# EAGLE schematic Speccy2007_128K_Ljubitel (EAGLE 6.3)
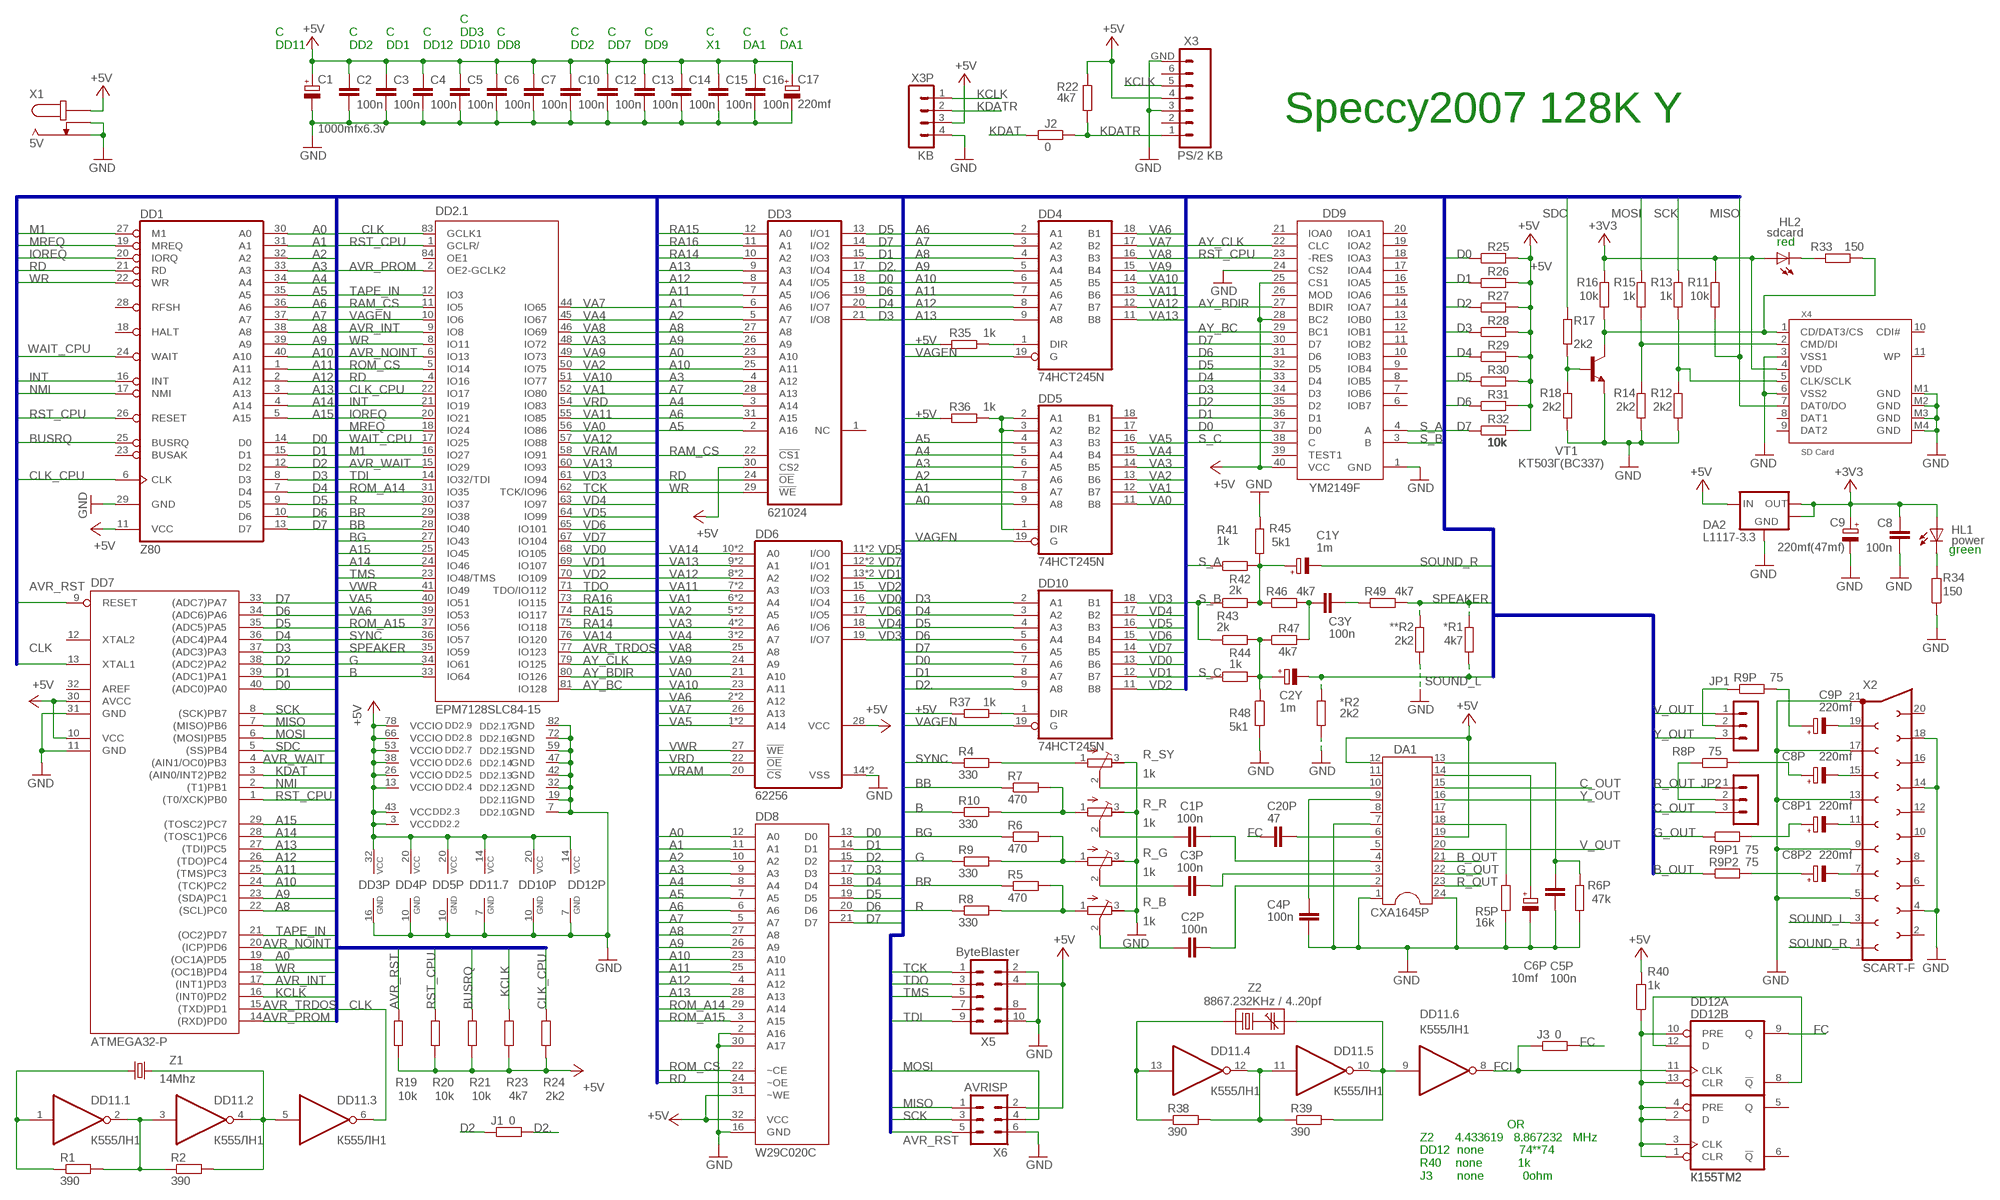
[diagram p0: schematic, sheet 1]

## Parts
**R2  2k2  R-EU_R1206  [R1206]
*R1  4k7  R-EU_R0805  [R0805]
*R2  2k2  R-EU_R0805  [R0805]
C1  1000mfx6.3v  CPOL-EUE3.5-8  [E3,5-8]
C1P  100n  C-EUC0805  [C0805]
C1Y  1m  CPOL-EUE2.5-5  [E2,5-5]
C2  100n  C-EUC0805  [C0805]
C2P  100n  C-EUC0805  [C0805]
C2Y  1m  CPOL-EUE2.5-5  [E2,5-5]
C3  100n  C-EUC0805  [C0805]
C3P  100n  C-EUC0805  [C0805]
C3Y  100n  C-EUC0805  [C0805]
C4  100n  C-EUC1206  [C1206]
C4P  100n  C-EUC0805  [C0805]
C5  100n  C-EUC0805  [C0805]
C5P  100n  C-EUC1206  [C1206]
C6  100n  C-EUC1206  [C1206]
C6P  10mf  CPOL-EUE2.5-5  [E2,5-5]
C7  100n  C-EUC0805  [C0805]
C8  100n  C-EUC0805  [C0805]
C8P  220mf  CPOL-EUE2.5-6  [E2,5-6]
C8P1  220mf  CPOL-EUE2.5-6  [E2,5-6]
C8P2  220mf  CPOL-EUE2.5-6  [E2,5-6]
C9  220mf(47mf)  CPOL-EUE2.5-6  [E2,5-6]
C9P  220mf  CPOL-EUE2.5-6  [E2,5-6]
C10  100n  C-EUC0805  [C0805]
C12  100n  C-EUC0805  [C0805]
C13  100n  C-EUC0805  [C0805]
C14  100n  C-EUC0805  [C0805]
C15  100n  C-EUC0805  [C0805]
C16  100n  C-EUC0805  [C0805]
C17  220mf  CPOL-EUE2.5-6  [E2,5-6]
C20P  47  C-EUC0805  [C0805]
DA1  CXA1645P  CXA1645-P  [DIL24-4]
DA2  L1117-3.3  AP1117  [SOT-223]
DD1  Z80  Z80CPU  [DIL40]
DD2  EPM7128SLC84-15  EPM7128-J84  [PGA-84-B]
DD3  621024  621024P  [DIL32]
DD4  74HCT245N  74HC245N  [DIL20]
DD5  74HCT245N  74HC245N  [DIL20]
DD6  62256  62256P+  [DIL28+6]
DD7  ATMEGA32-P  MEGA16-P  [DIL40]
DD8  W29C020C  [DIL32]
DD9  YM2149F  [DIL40]
DD10  74HCT245N  74HC245N  [DIL20]
DD11  К555ЛН1  74LS04N  [DIL14]
DD12  К155ТМ2  74LS74O  [DIL14O]
HL1  power  LEDSML0805  [SML0805]
HL2  sdcard  LEDSML0805  [SML0805]
J1  0  R-EU_M1206  [M1206]
J2  0  R-EU_R1206  [R1206]
J3  0  R-EU_R0805  [R0805]
JP1  MA03-1  [MA03-1]
JP2  MA03-1  [MA03-1]
R1  390  R-EU_R0805  [R0805]
R2  390  R-EU_R0805  [R0805]
R4  330  R-EU_R0805  [R0805]
R5  470  R-EU_R0805  [R0805]
R5P  16k  R-EU_M1206  [M1206]
R6  470  R-EU_R1206  [R1206]
R6P  47k  R-EU_R0805  [R0805]
R7  470  R-EU_0207/10  [0207/10]
R8  330  R-EU_R0805  [R0805]
R8P  75  R-EU_R1206  [R1206]
R9  330  R-EU_R0805  [R0805]
R9P  75  R-EU_R1206  [R1206]
R9P1  75  R-EU_R1206  [R1206]
R9P2  75  R-EU_R1206  [R1206]
R10  330  R-EU_R0805  [R0805]
R11  10k  R-EU_R0805  [R0805]
R12  2k2  R-EU_R1206  [R1206]
R13  1k  R-EU_R0805  [R0805]
R14  2k2  R-EU_R0805  [R0805]
R15  1k  R-EU_R0805  [R0805]
R16  10k  R-EU_R0805  [R0805]
R17  2k2  R-EU_R0805  [R0805]
R18  2k2  R-EU_R0805  [R0805]
R19  10k  R-EU_M0805  [M0805]
R20  10k  R-EU_R0805  [R0805]
R21  10k  R-EU_0207/10  [0207/10]
R22  4k7  R-EU_R0805  [R0805]
R23  4k7  R-EU_R1206  [R1206]
R24  2k2  R-EU_0207/10  [0207/10]
R25  10k  R-EU_R0805  [R0805]
R26  10k  R-EU_M0805  [M0805]
R27  10k  R-EU_R0805  [R0805]
R28  10k  R-EU_R0805  [R0805]
R29  10k  R-EU_R0805  [R0805]
R30  10k  R-EU_R0805  [R0805]
R31  10k  R-EU_R0805  [R0805]
R32  10k  R-EU_R0805  [R0805]
R33  150  R-EU_R1206  [R1206]
R34  150  R-EU_R0805  [R0805]
R35  1k  R-EU_R0805  [R0805]
R36  1k  R-EU_R0805  [R0805]
R37  1k  R-EU_R0805  [R0805]
R38  390  R-EU_R0805  [R0805]
R39  390  R-EU_R0805  [R0805]
R40  1k  R-EU_R0805  [R0805]
R41  1k  R-EU_R0805  [R0805]
R42  2k  R-EU_R0805  [R0805]
R43  2k  R-EU_R1206  [R1206]
R44  1k  R-EU_R1206  [R1206]
R45  5k1  R-EU_R1206  [R1206]
R46  4k7  R-EU_R1206  [R1206]
R47  4k7  R-EU_R0805  [R0805]
R48  5k1  R-EU_R0805  [R0805]
R49  4k7  R-EU_R0805  [R0805]
R_B  1k  R-TRIMM3296W  [RTRIM3296W]
R_G  1k  R-TRIMM3296W  [RTRIM3296W]
R_R  1k  R-TRIMM3296W  [RTRIM3296W]
R_SY  1k  R-TRIMM3296W  [RTRIM3296W]
VT1  KT503Г(BC337)  BC550-NPN-TO92-CBE  [TO92-CBE]
X1  5V  POWER3.5  [POWER3.5]
X2  SCART-F  [SCART-F]
X3  PS/2 KB  MINI-DIN6PTH  [MINI-DIN6]
X3P  KB  MA04-1  [MA04-1]
X4  SD Card  SDCARD  [SDCMF-10915W010]
X5  ByteBlaster  MA05-2  [MA05-2]
X6  AVRISP  MA03-2  [MA03-2]
Z1  14Mhz  CRYSTALHC49U-H  [HC49U-H]
Z2  8867.232KHz / 4..20pf  ZC  [HC49U-H]

## Nets
+3V3: C8.1 C9.+ DA2.2(OUT) DA2.4(OUT') HL1.A HL2.A R11.2 R16.2 X4.4(VDD)
+5V: C1.+ C2.1 C3.1 C4.1 C5.1 C6.1 C7.1 C10.1 C12.1 C13.1 C14.1 C15.1 C16.1 C17.+ DA1.12 DA1.19 DA2.3(IN) DD1.11(VCC) DD2.3(.2:VCC) DD2.13(.4:VCCIO) DD2.26(.5:VCCIO) DD2.38(.6:VCCIO) DD2.43(.3:VCC) DD2.53(.7:VCCIO) DD2.66(.8:VCCIO) DD2.78(.9:VCCIO) DD3.30(CS2) DD3.32(VCC) DD4.20(VCC) DD5.20(VCC) DD6.28(VCC) DD7.10(VCC) DD7.30(AVCC) DD8.31(~WE) DD8.32(VCC) DD9.25(CS1) DD9.28(BC2) DD9.40(VCC) DD10.20(VCC) DD11.14(.7:VCC) DD12.14(P:VCC) R19.1 R20.1 R21.1 R22.2 R23.1 R24.1 R25.2 R26.2 R27.2 R28.2 R29.2 R30.2 R31.2 R32.2 R35.2 R36.2 R37.2 R40.2 X1.P$1 X3.4 X3P.3 X5.4 X6.2
A0: DD1.30(A0) DD3.23(A10) DD5.9(A8) DD7.19((OC1A)PD5) DD8.12(A0)
A1: DD1.31(A1) DD3.6(A6) DD5.8(A7) DD8.11(A1)
A2: DD1.32(A2) DD3.5(A7) DD5.7(A6) DD8.10(A2)
A3: DD1.33(A3) DD3.4(A12) DD5.6(A5) DD8.9(A3)
A4: DD1.34(A4) DD3.3(A14) DD5.5(A4) DD8.8(A4)
A5: DD1.35(A5) DD3.2(A16) DD5.4(A3) DD8.7(A5)
A6: DD1.36(A6) DD3.31(A15) DD4.2(A1) DD8.6(A6)
A7: DD1.37(A7) DD3.28(A13) DD4.3(A2) DD8.5(A7)
A8: DD1.38(A8) DD3.27(A8) DD4.4(A3) DD7.22((SCL)PC0) DD8.27(A8)
A9: DD1.39(A9) DD3.26(A9) DD4.5(A4) DD7.23((SDA)PC1) DD8.26(A9)
A10: DD1.40(A10) DD3.25(A11) DD4.6(A5) DD7.24((TCK)PC2) DD8.23(A10)
A11: DD1.1(A11) DD3.7(A5) DD4.7(A6) DD7.25((TMS)PC3) DD8.25(A11)
A12: DD1.2(A12) DD3.8(A4) DD4.8(A7) DD7.26((TDO)PC4) DD8.4(A12)
A13: DD1.3(A13) DD3.9(A3) DD4.9(A8) DD7.27((TDI)PC5) DD8.28(A13)
A14: DD1.4(A14) DD2.24(.1:IO46) DD7.28((TOSC1)PC6)
A15: DD1.5(A15) DD2.25(.1:IO45) DD7.29((TOSC2)PC7)
AVR_INT: DD2.9(.1:IO8) DD7.17((INT1)PD3)
AVR_NOINT: DD2.6(.1:IO13) DD7.20((ICP)PD6)
AVR_PROM: DD2.2(.1:OE2-GCLK2) DD7.14((RXD)PD0)
AVR_RST: DD7.9(RESET) R19.2 X6.5
AVR_TRDOS: DD2.77(.1:IO123) DD7.15((TXD)PD1)
AVR_WAIT: DD2.15(.1:IO29) DD7.4((AIN1/OC0)PB3)
AY_BC: DD2.81(.1:IO128) DD9.29(BC1)
AY_BDIR: DD2.80(.1:IO126) DD9.27(BDIR)
AY_CLK: DD2.79(.1:IO125) DD9.22(CLC)
B: DD2.33(.1:IO64) R10.1
B_OUT: DA1.21 R9P2.1
BB: DD2.28(.1:IO40) R7.1
BG: DD2.27(.1:IO43) R6.1
BR: DD2.29(.1:IO38) R5.1
BUSRQ: DD1.25(BUSRQ) R21.2
C_OUT: DA1.15 JP2.3
CLK: DD2.83(.1:GCLK1) DD7.13(XTAL1) DD11.6(.3:O)
CLK_CPU: DD1.6(CLK) DD2.22(.1:IO17) R24.2
D0: DD1.14(D0) DD3.18(I/O5) DD7.40((ADC0)PA0) DD8.13(D0) DD9.37(D0) DD10.7(A6) R25.1
D1: DD1.15(D1) DD3.15(I/O3) DD7.39((ADC1)PA1) DD8.14(D1) DD9.36(D1) DD10.8(A7) R26.1
D2: DD1.12(D2) DD7.38((ADC2)PA2) DD9.35(D2) J1.1 R27.1
D2.: DD3.17(I/O4) DD8.15(D2) DD10.9(A8) J1.2
D3: DD1.8(D3) DD3.21(I/O8) DD7.37((ADC3)PA3) DD8.17(D3) DD9.34(D3) DD10.2(A1) R28.1
D4: DD1.7(D4) DD3.20(I/O7) DD7.36((ADC4)PA4) DD8.18(D4) DD9.33(D4) DD10.3(A2) R29.1
D5: DD1.9(D5) DD3.13(I/O1) DD7.35((ADC5)PA5) DD8.19(D5) DD9.32(D5) DD10.4(A3) R30.1
D6: DD1.10(D6) DD3.19(I/O6) DD7.34((ADC6)PA6) DD8.20(D6) DD9.31(D6) DD10.5(A4) R31.1
D7: DD1.13(D7) DD3.14(I/O2) DD7.33((ADC7)PA7) DD8.21(D7) DD9.30(D7) DD10.6(A5) R32.1
FC: C20P.1 DD12.9(B:Q) J3.2
FCI: DD11.8(.6:O) DD12.11(B:CLK) J3.1
G: DD2.34(.1:IO61) R9.1
G_OUT: DA1.22 R9P1.1
GND: **R2.1 *R2.1 C1.- C2.2 C3.2 C4.2 C4P.1 C5.2 C5P.1 C6.2 C6P.- C7.2 C8.2 C9.- C10.2 C12.2 C13.2 C14.2 C15.2 C16.2 C17.- DA1.1 DA1.7 DA1.24 DA2.1(GND) DD1.29(GND) DD2.7(.10:GND) DD2.19(.11:GND) DD2.32(.12:GND) DD2.42(.13:GND) DD2.47(.14:GND) DD2.59(.15:GND) DD2.72(.16:GND) DD2.82(.17:GND) DD3.16(GND) DD4.10(GND) DD5.10(GND) DD6.14(VSS) DD6.P$14(VSS) DD7.11(GND) DD7.31(GND) DD8.2(A16) DD8.16(GND) DD8.30(A17) DD9.1(GND) DD9.24(CS2) DD10.10(GND) DD11.7(.7:GND) DD12.7(P:GND) R5P.1 R6P.1 R12.1 R14.1 R18.1 R34.1 R45.2 R48.2 R_B.3(A) R_G.3(A) R_R.3(A) R_SY.3(A) VT1.E X1.P$2 X1.P$3 X2.4 X2.5 X2.9 X2.13 X2.14 X2.17 X2.18 X2.21 X3.3 X3.GND X3P.4 X4.3(VSS1) X4.6(VSS2) X4.M1(GND) X4.M2(GND) X4.M3(GND) X4.M4(GND) X5.2 X5.10 X6.6
INT: DD1.16(INT) DD2.21(.1:IO19)
IOREQ: DD1.20(IORQ) DD2.20(.1:IO21)
KCLK: DD7.16((INT0)PD2) R23.2 X3.5 X3P.1
KDAT: DD7.3((AIN0/INT2)PB2) J2.1
KDATR: J2.2 R22.1 X3.1 X3P.2
M1: DD1.27(M1) DD2.16(.1:IO27)
MISO: DD7.7((MISO)PB6) R11.1 X4.7(DAT0/DO) X6.1
MOSI: DD7.6((MOSI)PB5) R15.2 X6.4
MREQ: DD1.19(MREQ) DD2.18(.1:IO24)
N$1: DD11.4(.2:O) DD11.5(.3:I) R2.2 Z1.2
N$2: C3Y.1 R46.2 R47.2
N$3: C3Y.2 R49.1
N$4: C1Y.+ R41.2 R42.2 R45.1 R46.1
N$5: DD11.2(.1:O) DD11.3(.2:I) R1.2 R2.1
N$6: R4.2 R_SY.1(E)
N$7: C2Y.+ R43.2 R44.2 R47.1 R48.1
N$8: R7.2 R10.2 R_R.1(E)
N$9: R6.2 R9.2 R_G.1(E)
N$10: R5.2 R8.2 R_B.1(E)
N$11: C1P.1 R_R.2(S)
N$12: DD11.1(.1:I) R1.1 Z1.1
N$13: C3P.1 R_G.2(S)
N$14: C2P.1 R_B.2(S)
N$16: R16.1 R33.1 VT1.C X4.1(CD/DAT3/CS)
N$17: R17.1 R18.2 VT1.B
N$19: R12.2 R13.1 X4.5(CLK/SCLK)
N$21: R14.2 R15.1 X4.2(CMD/DI)
N$22: DA1.10 R_SY.2(S)
N$23: DD10.1(DIR) R37.1
N$24: DD5.1(DIR) DD5.2(A1) DD5.3(A2) R36.1
N$27: C9P.- X2.19
N$28: JP1.2 R9P.1
N$29: C4P.2 DA1.9
N$30: C8P.- X2.15
N$31: JP2.2 R8P.1
N$32: C8P1.- X2.11
N$33: C8P2.- X2.7
N$34: C8P1.+ R9P1.2
N$35: C2P.2 DA1.2
N$36: C8P2.+ R9P2.2
N$38: DD12.8(B:!Q) DD12.12(B:D)
N$39: HL1.C R34.2
N$40: DD12.1(A:CLR) DD12.2(A:D) DD12.3(A:CLK) DD12.4(A:PRE) DD12.10(B:PRE) DD12.13(B:CLR) R40.1
N$41: HL2.C R33.2
N$42: DD4.1(DIR) R35.1
N$43: DD11.11(.5:I) DD11.12(.4:O) R38.2 R39.1
N$44: DD11.9(.6:I) DD11.10(.5:O) R39.2 Z2.2
N$45: DD11.13(.4:I) R38.1 Z2.1
N$46: C3P.2 DA1.3
N$47: C1P.2 DA1.4
N$49: C9P.+ R9P.2
N$50: DA1.18 R5P.2
N$52: C5P.2 DA1.13 R6P.2
N$53: C6P.+ DA1.14
N$57: C8P.+ R8P.2
N$62: C20P.2 DA1.6
NMI: DD1.17(NMI) DD7.2((T1)PB1)
R: DD2.30(.1:IO37) R8.1
R_OUT: DA1.23 JP2.1
RA14: DD2.75(.1:IO118) DD3.10(A2)
RA15: DD2.74(.1:IO117) DD3.12(A0)
RA16: DD2.73(.1:IO115) DD3.11(A1)
RAM_CS: DD2.11(.1:IO5) DD3.22(!CS1)
RD: DD1.21(RD) DD2.4(.1:IO16) DD3.24(!OE) DD8.24(~OE)
ROM_A14: DD2.31(.1:IO35) DD8.29(A14)
ROM_A15: DD2.37(.1:IO56) DD8.3(A15)
ROM_CS: DD2.5(.1:IO14) DD8.22(~CE)
RST_CPU: DD1.26(RESET) DD2.1(.1:GCLR/) DD7.1((T0/XCK)PB0) DD9.23(-RES) R20.2
S_A: DD9.4(A) R41.1
S_B: DD9.3(B) R42.1 R43.1
S_C: DD9.38(C) R44.1
SCK: DD7.8((SCK)PB7) R13.2 X6.3
SDC: DD7.5((SS)PB4) R17.2
SOUND_L: *R1.1 *R2.2 C2Y.- X2.3
SOUND_R: C1Y.- X2.1
SPEAKER: **R2.2 *R1.2 DD2.35(.1:IO59) R49.2
SYNC: DD2.36(.1:IO57) R4.1
TAPE_IN: DD2.12(.1:IO3) DD7.21((OC2)PD7)
TCK: DD2.62(.1:TCK/IO96) X5.1
TDI: DD2.14(.1:IO32/TDI) X5.9
TDO: DD2.71(.1:TDO/IO112) X5.3
TMS: DD2.23(.1:IO48/TMS) X5.5
V_OUT: DA1.20 JP1.1
VA0: DD2.56(.1:IO86) DD5.11(B8) DD6.21(A10)
VA1: DD2.52(.1:IO80) DD5.12(B7) DD6.6(A4) DD6.P$6(A4)
VA2: DD2.50(.1:IO75) DD5.13(B6) DD6.5(A5) DD6.P$5(A5)
VA3: DD2.48(.1:IO72) DD5.14(B5) DD6.4(A6) DD6.P$4(A6)
VA4: DD2.45(.1:IO67) DD5.15(B4) DD6.3(A7) DD6.P$3(A7)
VA5: DD2.40(.1:IO51) DD5.16(B3) DD6.1(A14) DD6.P$1(A14)
VA6: DD2.39(.1:IO53) DD4.18(B1) DD6.2(A12) DD6.P$2(A12)
VA7: DD2.44(.1:IO65) DD4.17(B2) DD6.26(A13)
VA8: DD2.46(.1:IO69) DD4.16(B3) DD6.25(A8)
VA9: DD2.49(.1:IO73) DD4.15(B4) DD6.24(A9)
VA10: DD2.51(.1:IO77) DD4.14(B5) DD6.23(A11)
VA11: DD2.55(.1:IO85) DD4.13(B6) DD6.7(A3) DD6.P$7(A3)
VA12: DD2.57(.1:IO88) DD4.12(B7) DD6.8(A2) DD6.P$8(A2)
VA13: DD2.60(.1:IO93) DD4.11(B8) DD6.9(A1) DD6.P$9(A1)
VA14: DD2.76(.1:IO120) DD6.10(A0) DD6.P$10(A0)
VAGEN: DD2.10(.1:IO6) DD4.19(G) DD5.19(G) DD10.19(G)
VD0: DD2.68(.1:IO105) DD6.16(I/O4) DD10.13(B6)
VD1: DD2.69(.1:IO107) DD6.13(I/O2) DD6.P$13(I/O2) DD10.12(B7)
VD2: DD2.70(.1:IO109) DD6.15(I/O3) DD10.11(B8)
VD3: DD2.61(.1:IO94) DD6.19(I/O7) DD10.18(B1)
VD4: DD2.63(.1:IO97) DD6.18(I/O6) DD10.17(B2)
VD5: DD2.64(.1:IO99) DD6.11(I/O0) DD6.P$11(I/O0) DD10.16(B3)
VD6: DD2.65(.1:IO101) DD6.17(I/O5) DD10.15(B4)
VD7: DD2.67(.1:IO104) DD6.12(I/O1) DD6.P$12(I/O1) DD10.14(B5)
VRAM: DD2.58(.1:IO91) DD6.20(!CS)
VRD: DD2.54(.1:IO83) DD6.22(!OE)
VWR: DD2.41(.1:IO49) DD6.27(!WE)
WAIT_CPU: DD1.24(WAIT) DD2.17(.1:IO25)
WR: DD1.22(WR) DD2.8(.1:IO11) DD3.29(!WE) DD7.18((OC1B)PD4)
Y_OUT: DA1.16 JP1.3
Unconnected: DA1.5 DA1.8 DA1.11 DA1.17 DD1.18(HALT) DD1.23(BUSAK) DD1.28(RFSH) DD2.84(.1:OE1) DD3.1(NC) DD5.17(B2) DD5.18(B1) DD7.12(XTAL2) DD7.32(AREF) DD9.6(IOB7) DD9.7(IOB6) DD9.8(IOB5) DD9.9(IOB4) DD9.10(IOB3) DD9.11(IOB2) DD9.12(IOB1) DD9.13(IOB0) DD9.14(IOA7) DD9.15(IOA6) DD9.16(IOA5) DD9.17(IOA4) DD9.18(IOA3) DD9.19(IOA2) DD9.20(IOA1) DD9.21(IOA0) DD9.26(MOD) DD9.39(TEST1) DD12.5(A:Q) DD12.6(A:!Q) X2.2 X2.6 X2.8 X2.10 X2.12 X2.16 X2.20 X3.2 X3.6 X4.8(DAT1) X4.9(DAT2) X4.10(CDI#) X4.11(WP) X5.7 X5.8

## Buses
A,A[0..15],RA[14..16],AVR_INT,AVR_NOINT,AVR_PROM,AVR_RST,AVR_TRDOS,AVR_WAIT,AY_BC,AY_BDIR,AY_CLK,B,BB,BG,BR,BUSRQ,C,CLK,CLK_CPU,D[0..7],D2.,G,INT,IOREQ,KCLK,KDAT,M1,MISO,MOSI,MREQ,NMI,R,RAM_A[14..16],RAM_CS,RD,ROM_A[14..15],ROM_CS,RST_CPU,SCK,SDC,SOUND_L,SOUND_R,SPEAKER,SYNC,TAPE_IN,TCK,TDI,TDO,TMS,VA[0..14],VAGEN,VD[0..7],VRAM,VRD,VWR,WAIT_CPU,WR,B_OUT,C_OUT,G_OUT,R_OUT,Y_OUT,S_A,S_B,S_C,V_OUT,+5V

## Notes on the sheet
- C
  DD11
- C
  DD2
- C
  DD1
- C
  DD12
- C
  DD3
  DD10
- C
  DD8
- C
  DD2
- C
  DD7
- C
  DD9
- C
  X1
- C
  DA1
- C
  DA1
- Speccy2007 128K Y
- red
- green
- OR
  Z2      4.433619   8.867232   MHz
  DD12  none          74**74
  R40    none          1k
  J3       none           0ohm

## Library data of the parts
**R2 *R1 *R2 J1-J3 R1 R2 R4 R5 R5P R6 R6P R8 R8P R9 R9P R9P1 R9P2 R10-R20 R22 R23 R25-R49 = rcl:R-EU_: RESISTOR, European symbol
C1 C1Y C2Y C6P C8P C8P1 C8P2 C9 C9P C17 = Speccy:CPOL-EU: POLARIZED CAPACITOR, European symbol
C1P C2 C2P C3 C3P C3Y C4 C4P C5 C5P C6-C8 C10 C12-C16 C20P = rcl:C-EU: CAPACITOR, European symbol
DA1 = cxa1645:CXA1645: Dual In Line
DA2 = AWJLEagleLib:AP1117: Diodes Incorporated AP1117 LDO adjustable regulator
DD1 = zilog:Z80CPU: Z80 FAMILY DEVICE
DD2 = Speccy:EPM7128-J84: EPM70128 MAX 7000 family
DD3 = Speccy:621024: MEMORY; OC_FARNELL: unknown; OC_NEWARK: unknown
DD4 DD5 DD10 = Speccy:74*245: Octal BUS TRANSCEIVER, 3-state
DD6 = Speccy:62256: MEMORY
DD7 = atmel:MEGA16-P: MICROCONTROLLER 16 Kbytes FLASH 1 kbytes SRAM 512 bytes EEPROM USART 8-channel 10 bit ADC Source: avr.lbr; MPN: ATMEGA16-16PU; OC_FARNELL: 9171142; OC_NEWARK: 01M6885
DD8 = w29c020:W29C020
DD9 = ref-pack_:YM2149F
DD11 = Speccy:74*04: Hex INVERTER
DD12 = Speccy:74*74: Dual D type positive edge triggered FLIP FLOP, preset and clear
HL1 HL2 = led:LED: LED OSRAM: - CHIPLED LG R971, LG N971, LY N971, LG Q971, LY Q971, LO R971, LY R971 LH N974, LH R974 LS Q976, LO Q976, LY Q976 LO Q996 - Hyper CHIPLED LW Q18S LB Q993, LB Q99A, LB R99A - SideLED LS A670, LO A670, LY A670, LG A670, LP A670 LB A673, LV A673, LT A673, LW A673 LH A674 LY A675 LS A676, LA A676, LO A676, LY A676, LW A676 LS A679, LY A679, LG A679 - Hyper Micro SIDELED® LS Y876, LA Y876, LO Y876, LY Y876 LT Y87S - SmartLED LW L88C, LW L88S LB L89C, LB L89S, LG L890 LS L89K, LO L89K, LY L89K LS L896, LA L896, LO L896, LY L896 - TOPLED LS T670, LO T670, LY T670, LG T670, LP T670 LSG T670, LSP T670, LSY T670, LOP T670, LYG T670 LG T671, LOG T671, LSG T671 LB T673, LV T673, LT T673, LW T673 LH T674 LS T676, LA T676, LO T676, LY T676, LB T676, LH T676, LSB T676, LW T676 LB T67C, LV T67C, LT T67C, LS T67K, LO T67K, LY T67K, LW E67C LS E67B, LA E67B, LO E67B, LY E67B, LB E67C, LV E67C, LT E67C LW T67C LS T679, LY T679, LG T679 LS T770, LO T770, LY T770, LG T770, LP T770 LB T773, LV T773, LT T773, LW T773 LH T774 LS E675, LA E675, LY E675, LS T675 LS T776, LA T776, LO T776, LY T776, LB T776 LHGB T686 LT T68C, LB T68C - Hyper Mini TOPLED® LB M676 - Mini TOPLED Santana® LG M470 LS M47K, LO M47K, LY M47K Source: http://www.osram.convergy.de LUXEON: - LUMILED® LXK2-PW12-R00, LXK2-PW12-S00, LXK2-PW14-U00, LXK2-PW14-V00 LXK2-PM12-R00, LXK2-PM12-S00, LXK2-PM14-U00 LXK2-PE12-Q00, LXK2-PE12-R00, LXK2-PE12-S00, LXK2-PE14-T00, LXK2-PE14-U00 LXK2-PB12-K00, LXK2-PB12-L00, LXK2-PB12-M00, LXK2-PB14-N00, LXK2-PB14-P00, LXK2-PB14-Q00 LXK2-PR12-L00, LXK2-PR12-M00, LXK2-PR14-Q00, LXK2-PR14-R00 LXK2-PD12-Q00, LXK2-PD12-R00, LXK2-PD12-S00 LXK2-PH12-R00, LXK2-PH12-S00 LXK2-PL12-P00, LXK2-PL12-Q00, LXK2-PL12-R00 Source: www.luxeon.com KINGBRIGHT: KA-3528ASYC Source: www.kingbright.com
JP1 JP2 = con-lstb:MA03-1: PIN HEADER; OC_FARNELL: unknown; OC_NEWARK: unknown
R7 R21 R24 = Speccy:R-EU_: RESISTOR, European symbol
R_B R_G R_R R_SY = Speccy:R-TRIMM: Trimm resistor
VT1 = transistor:*-NPN-: NPN Transistror BF959 corrected 2008.03.06
X1 = Speccy:POWER3.5
X2 = con-hirschmann:SCART-F: TV SCART CONNECTOR; OC_FARNELL: unknown; OC_NEWARK: unknown
X3 = Speccy:MINI-DIN6: mini DIN 6 Connector Commonly found on the back of a computer for PS2 keyboard and mice. Schematic and footprint are proven. Spark Fun Electronics SKU : PRT-08509
X3P = con-lstb:MA04-1: PIN HEADER; OC_FARNELL: unknown; OC_NEWARK: unknown
X4 = Speccy:SDCARD: SD card connector KINGFONT SDCMF-10915W010
X5 = Speccy:MA05-2: PIN HEADER; OC_FARNELL: unknown; OC_NEWARK: unknown
X6 = Speccy:MA03-2: PIN HEADER; OC_FARNELL: unknown; OC_NEWARK: unknown
Z1 = Speccy:CRYSTAL: CRYSTAL; OC_FARNELL: 1666973; OC_NEWARK: unknown
Z2 = Speccy:ZC